# Altium schematic sheet Receiver_Schematic.SchDoc
size A4
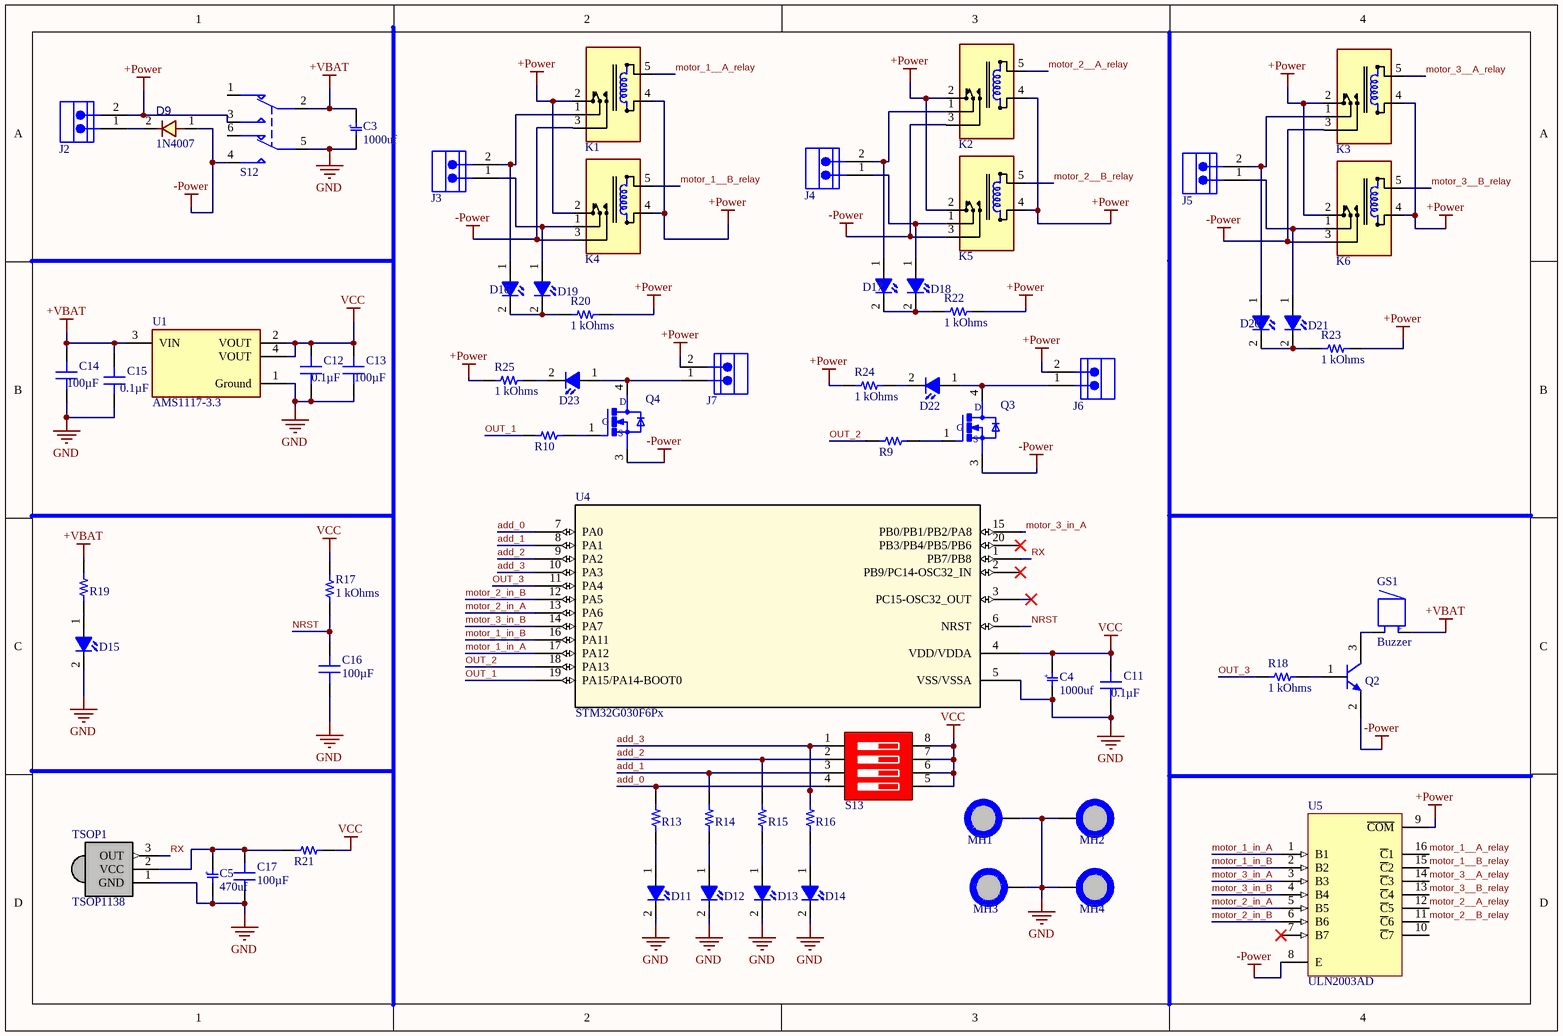
[diagram p0: Receiver_Schematic.SchDoc]

## Parts
C3  value 1000uf  [Cap_3_(3.5mm)]  (hidden comment: Capacitor Electrical THD)
C4  value 1000uf  [Cap_3_(3.5mm)]  (hidden comment: Capacitor Electrical THD)
C5  value 470uf  [Cap_3_(3.5mm)]  (hidden comment: Capacitor Electrical THD)
C11  0.1µF  [CAP 0805_2012]
C12  0.1µF  [CAP 0805_2012]
C13  100µF  [CAP 0805_2012]
C14  100µF  [CAP 0805_2012]
C15  0.1µF  [CAP 0805_2012]
C16  100µF  [CAP 0805_2012]
C17  100µF  [CAP 0805_2012]
D9  value 1N4007  [D_SMA]  (hidden comment: 1N4007 SMD M7)
D11  LED THD 3mm  [LED THD 3mm (White)]  (value not drawn)
D12  LED THD 3mm  [LED THD 3mm (White)]  (value not drawn)
D13  LED THD 3mm  [LED THD 3mm (White)]  (value not drawn)
D14  LED THD 3mm  [LED THD 3mm (White)]  (value not drawn)
D15  LED THD 3mm  [LED THD 3mm (White)]  (value not drawn)
D16  LED THD 3mm  [LED THD 3mm (White)]  (value not drawn)
D17  LED THD 3mm  [LED THD 3mm (White)]  (value not drawn)
D18  LED THD 3mm  [LED THD 3mm (White)]  (value not drawn)
D19  LED THD 3mm  [LED THD 3mm (White)]  (value not drawn)
D20  LED THD 3mm  [LED THD 3mm (White)]  (value not drawn)
D21  LED THD 3mm  [LED THD 3mm (White)]  (value not drawn)
D22  LED THD 3mm  [LED THD 3mm (White)]  (value not drawn)
D23  LED THD 3mm  [LED THD 3mm (White)]  (value not drawn)
GS1  Buzzer  [BZ_SJ]
J2  Socket Blue 2  [Socket Blue 2]  (value not drawn)
J3  Socket Blue 2  [Socket Blue 2]  (value not drawn)
J4  Socket Blue 2  [Socket Blue 2]  (value not drawn)
J5  Socket Blue 2  [Socket Blue 2]  (value not drawn)
J6  Socket Blue 2  [Socket Blue 2]  (value not drawn)
J7  Socket Blue 2  [Socket Blue 2]  (value not drawn)
K1  RELAY SPST 5 Pin Millon  [REL_SPDT_5_2216]  (value not drawn)
K2  RELAY SPST 5 Pin Millon  [REL_SPDT_5_2216]  (value not drawn)
K3  RELAY SPST 5 Pin Millon  [REL_SPDT_5_2216]  (value not drawn)
K4  RELAY SPST 5 Pin Millon  [REL_SPDT_5_2216]  (value not drawn)
K5  RELAY SPST 5 Pin Millon  [REL_SPDT_5_2216]  (value not drawn)
K6  RELAY SPST 5 Pin Millon  [REL_SPDT_5_2216]  (value not drawn)
MH1  MH_7.4mmC_3.2mmD  [MH_7.4mmC_3.2mmD]  (value not drawn)  (no BOM)
MH2  MH_7.4mmC_3.2mmD  [MH_7.4mmC_3.2mmD]  (value not drawn)  (no BOM)
MH3  MH_7.4mmC_3.2mmD  [MH_7.4mmC_3.2mmD]  (value not drawn)  (no BOM)
MH4  MH_7.4mmC_3.2mmD  [MH_7.4mmC_3.2mmD]  (value not drawn)  (no BOM)
Q2  MMBT2222A-7-F  [DIODES SOT-23-3]  (value not drawn)
Q3  PHD45N03LTA  [TO228P1000X238-3N]  (value not drawn)
Q4  PHD45N03LTA  [TO228P1000X238-3N]  (value not drawn)
R9  100 Ohms  [RES 0805_2012]  (value not drawn)
R10  100 Ohms  [RES 0805_2012]  (value not drawn)
R13  50 mOhms  [RES 0805_2012]  (value not drawn)
R14  50 mOhms  [RES 0805_2012]  (value not drawn)
R15  50 mOhms  [RES 0805_2012]  (value not drawn)
R16  50 mOhms  [RES 0805_2012]  (value not drawn)
R17  1 kOhms  [RES 0805_2012]
R18  1 kOhms  [RES 0805_2012]
R19  150 Ohms  [RES 0805_2012]  (value not drawn)
R20  1 kOhms  [RES 0805_2012]
R21  100 Ohms  [RES 0805_2012]  (value not drawn)
R22  1 kOhms  [RES 0805_2012]
R23  1 kOhms  [RES 0805_2012]
R24  1 kOhms  [RES 0805_2012]
R25  1 kOhms  [RES 0805_2012]
S12  Double Switch  [SWPUST_DPDT_S2]  (value not drawn)
S13  DIP Switch 4  [dip switch 4  Blue THD]  (value not drawn)
TSOP1  TSOP1138  [TSOP11XX & 13XX]
U1  AMS1117-3.3  [SOT223-4N]
U4  STM32G030F6Px  [TSSOP20]
U5  ULN2003AD  [SOIC16]

## Nets
+Power: J2.2 J6.2 J7.2 K1.2(NC) K1.4(T1) K2.2(NC) K2.4(T1) K3.2(NC) K3.4(T1) K4.2(NC) K4.4(T1) K5.2(NC) K5.4(T1) K6.2(NC) K6.4(T1) R20.2 R22.2 R23.2 R24.1 R25.1 S12.3 U5.9(~{COM})
+VBAT: C3.1 C14.2 C15.2 GS1.1(+) R19.2 S12.2 U1.3(VIN)
-Power: D9.1 K1.3(NO) K2.3(NO) K3.3(NO) K4.3(NO) K5.3(NO) K6.3(NO) Q2.2(E) Q3.3(S) Q4.3(S) S12.4 U5.8(E)
GND: C3.2 C4.2 C5.2 C11.1 C12.1 C13.1 C14.1 C15.1 C16.1 C17.1 D11.2(CATHODE) D12.2(CATHODE) D13.2(CATHODE) D14.2(CATHODE) D15.2(CATHODE) MH1.0 MH2.0 MH3.0 MH4.0 S12.5 TSOP1.1(GND) U1.1(Ground) U4.5(VSS/VSSA)
VCC: C4.1 C11.2 C12.2 C13.2 R17.1 R21.2 S13.5 S13.6 S13.7 S13.8 U1.2(VOUT) U1.4(VOUT) U4.4(VDD/VDDA)
add_0: R13.2 S13.4 U4.7(PA0)
add_1: R14.2 S13.3 U4.8(PA1)
add_2: R15.2 S13.2 U4.9(PA2)
add_3: R16.2 S13.1 U4.10(PA3)
motor_1__A_relay: K1.5(T2) U5.16(~{C}1)
motor_1__B_relay: K4.5(T2) U5.15(~{C}2)
motor_1_in_A: U4.17(PA12) U5.1(B1)
motor_1_in_B: U4.16(PA11) U5.2(B2)
motor_2__A_relay: K2.5(T2) U5.12(~{C}5)
motor_2__B_relay: K5.5(T2) U5.11(~{C}6)
motor_2_in_A: U4.13(PA6) U5.5(B5)
motor_2_in_B: U4.12(PA5) U5.6(B6)
motor_3__A_relay: K3.5(T2) U5.14(~{C}3)
motor_3__B_relay: K6.5(T2) U5.13(~{C}4)
motor_3_in_A: U4.15(PB0/PB1/PB2/PA8) U5.3(B3)
motor_3_in_B: U4.14(PA7) U5.4(B4)
NRST: C16.2 R17.2 U4.6(NRST)
OUT_1: R10.1 U4.19(PA15/PA14-BOOT0)
OUT_2: R9.1 U4.18(PA13)
OUT_3: R18.1 U4.11(PA4)
RX: TSOP1.3(OUT) U4.1(PB7/PB8)
NetC5_1: C5.1 C17.2 R21.1 TSOP1.2(VCC)
NetD9_2: D9.2 J2.1
NetD11_1: D11.1(ANODE) R13.1
NetD12_1: D12.1(ANODE) R14.1
NetD13_1: D13.1(ANODE) R15.1
NetD14_1: D14.1(ANODE) R16.1
NetD15_1: D15.1(ANODE) R19.1
NetD16_1: D16.1(ANODE) J3.2 K1.1(COM)
NetD16_2: D16.2(CATHODE) D19.2(CATHODE) R20.1
NetD17_1: D17.1(ANODE) J4.2 K2.1(COM)
NetD17_2: D17.2(CATHODE) D18.2(CATHODE) R22.1
NetD18_1: D18.1(ANODE) J4.1 K5.1(COM)
NetD19_1: D19.1(ANODE) J3.1 K4.1(COM)
NetD20_1: D20.1(ANODE) J5.2 K3.1(COM)
NetD20_2: D20.2(CATHODE) D21.2(CATHODE) R23.1
NetD21_1: D21.1(ANODE) J5.1 K6.1(COM)
NetD22_1: D22.1(ANODE) J6.1 Q3.4(D)
NetD22_2: D22.2(CATHODE) R24.2
NetD23_1: D23.1(ANODE) J7.1 Q4.4(D)
NetD23_2: D23.2(CATHODE) R25.2
NetGS1_2: GS1.2(-) Q2.3(C)
NetQ2_1: Q2.1(B) R18.2
NetQ3_1: Q3.1(G) R9.2
NetQ4_1: Q4.1(G) R10.2

Not connected (* = marked no-connect by the designer): S12 1 6; U4 2(PB9/PC14-OSC32_IN)* 3(PC15-OSC32_OUT)* 20(PB3/PB4/PB5/PB6)*; U5 7(B7)* 10(~{C}7)

## Notes on the sheet
- (in symbol Capacitor Electrical THD) +

## Library data of the parts
C11 C12 C15 = AC0805KKX8R9BB104: CAP CER 0805 10% X8R 50V 100NF; Manufacturer: Yageo; Part Number: AC0805KKX8R9BB104; Applications: Automotive; Capacitance: 0.1µF; ComponentLink1Description: Datasheet; ComponentLink1URL: http://www.yageo.com/documents/recent/AC0805KKX8R9BB104.pdf; ComponentLink2Description: DigiKey Link; ComponentLink2URL: http://digikey.com/product-detail/en/yageo/AC0805KKX8R9BB104/311-4624-1-ND/9699550; Device Package: 0805 (2012 Metric); LastUpdated: 2020-09-02 01:04:19.917000; Lifecycle Status: Active; Minimum Order: 1; Mounting Type: Surface Mount, MLCC; Operating Temperature: -55°C ~ 150°C; Package / Case: 0805 (2012 Metric); Packaging: TapeAndReel; PartId: 14076; Part Status: Active; Price: 0.06; Ratings: AEC-Q200; Series: AC; Size / Dimension: 0.079 L x 0.049 W (2.00mm x 1.25mm); Supplier 1: DigiKey; Supplier Part Number 1: 311-4624-1-ND; Temperature Coefficient: X8R; Thickness (Max): 0.057 (1.45mm); Tolerance: ±10%; Value: 0.1µF; Voltage - Rated: 50V
C13 C14 C16 C17 = GRM21BR60J107ME15L: CAP CER 100UF 6.3V X5R 0805; Manufacturer: Murata Electronics; Tolerance: ±20%; Part Number: GRM21BR60J107ME15L; Applications: General Purpose; Capacitance: 100µF; ComponentLink1Description: Datasheet; ComponentLink1URL: https://search.murata.co.jp/Ceramy/image/img/A01X/G101/ENG/GRM21BR60J107ME15-01.pdf; ComponentLink2Description: DigiKey Link; ComponentLink2URL: http://digikey.com/product-detail/en/murata-electronics/GRM21BR60J107ME15L/490-13981-1-ND/6155811; Device Package: 0805 (2012 Metric); LastUpdated: 2020-09-02 01:04:10.617000; Lifecycle Status: Active; Minimum Order: 1; Mounting Type: Surface Mount, MLCC; Operating Temperature: -55°C ~ 85°C; Package / Case: 0805 (2012 Metric); Packaging: TapeAndReel; PartId: 16995; Part Status: Active; Price: 0.61; Series: GRM; Size / Dimension: 0.079 L x 0.049 W (2.00mm x 1.25mm); Supplier 1: DigiKey; Supplier Part Number 1: 490-13981-1-ND; Temperature Coefficient: X5R; Thickness (Max): 0.057 (1.45mm); Value: 100µF; Voltage - Rated: 6.3V
D9 = 1N4007 SMD M7: DIODE, GENERAL PURPOSE, 1000V/1A; DatasheetVersion: 2021; ComponentLink1Description: Website Smart World; ComponentLink1URL: https://www.smartw.ir/; ComponentLink2Description: Telegram; ComponentLink2URL: https://t.me/altium_smartw; ComponentLink3Description: Instagram; ComponentLink3URL: https://Instagram.com/smartgw.ir
GS1 = Buzzer: Magnetic Transducer Buzzer; Company: SJ Libraries; Designer: Eng. Saeid Jorablo; PackageReference: ABSM-1574; PackageDescription: Magnetic Transducer Buzzer; Mounting Technology: Surface Mount\Through-Hole; ComponentLink1Description: Datasheet; Pin Count: 0; Category: MISC; HelpURL: http://s3.picofile.com/file/7443264187/Coming_Soon_logo.gif; ComponentLink2Description: Reference; Publisher: SJ Unlimited; Status: Unreleased
K1-K6 = RELAY SPST 5 Pin Millon: Relay; ComponentLinkp-URL: https://www.smartw.ir/; DatasheetVersion: 2021; ComponentLink1Description: Website Smart World; ComponentLink1URL: https://www.smartw.ir/; ComponentLink2Description: Telegram; ComponentLink2URL: https://t.me/altium_smartw; ComponentLink3Description: Instagram; ComponentLink3URL: https://Instagram.com/smartgw.ir
MH1-MH4 = MH_7.4mmC_3.2mmD: MH_7.4MM Diameter,3.2mm Drill
Q2 = MMBT2222A-7-F: TRANS NPN 40V 0.6A SMD SOT23-3; Manufacturer: Diodes Incorporated; Current - Collector Cutoff (Max): 10nA (ICBO); Current - Collector (Ic) (Max): 600mA; DC Current Gain (hFE) (Min) @ Ic, Vce: 100 @ 150mA, 10V; Frequency - Transition: 300MHz; Power - Max: 310mW; Vce Saturation (Max) @ Ib, Ic: 1V @ 50mA, 500mA; Part Number: MMBT2222A-7-F; ComponentLink1Description: Datasheet; ComponentLink1URL: https://www.diodes.com/assets/Datasheets/ds30041.pdf; ComponentLink2Description: DigiKey Link; ComponentLink2URL: http://digikey.com/product-detail/en/diodes-incorporated/MMBT2222A-7-F/MMBT2222A-FDICT-ND/815723; LastUpdated: 2020-09-02 01:30:06.317000; Lifecycle Status: Active; Minimum Order: 1; Mounting Type: Surface Mount; Operating Temperature: -55°C ~ 150°C (TJ); Package / Case: TO-236-3, SC-59, SOT-23-3; Packaging: TapeAndReel; PartId: 84; Part Status: Active; Price: 0.02; Series: Automotive, AEC-Q101; Supplier 1: DigiKey; Supplier Part Number 1: MMBT2222A-FDICT-ND; Supplier Device Package: SOT-23-3; Transistor Type: NPN; Voltage - Collector Emitter Breakdown (Max): 40V
Q3 Q4 = PHD45N03LTA: Bipolar Transistors - BJT; MF: NXP USA; Package: TO-252-3 NXP USA; Price: None; SnapEDA_Link: https://www.snapeda.com/parts/PHD45N03LTA/NXP%20USA%20Inc./view-part/554376/?ref=snap; Availability: Unavailable; Value: *; MP: PHD45N03LTA
R9 R10 = RCS0805100RFKEA: RES SMD 100 OHM 1% 0.4W 0805; Manufacturer: Vishay Dale; Power (Watts): 0.4W, 2/5W; Temperature Coefficient: ±100ppm/°C; Part Number: RCS0805100RFKEA; ComponentLink1Description: Datasheet; ComponentLink1URL: http://www.vishay.com/docs/20065/rcse3.pdf; ComponentLink2Description: DigiKey Link; ComponentLink2URL: http://digikey.com/product-detail/en/vishay-dale/RCS0805100RFKEA/541-2834-1-ND/5867127; Composition: Thick Film; Device Package: 0805 (2012 Metric); Features: Automotive AEC-Q200, Pulse Withstanding; Height - Seated (Max): 0.020 (0.50mm); LastUpdated: 2020-09-02 01:15:23.790000; Lifecycle Status: Active; Minimum Order: 1; Number of Terminations: 2; Operating Temperature: -55°C ~ 155°C; Package / Case: 0805 (2012 Metric); Packaging: TapeAndReel; PartId: 27784; Part Status: Active; Price: 0.03; Ratings: AEC-Q200; Resistance: 100 Ohms; Series: RCS e3; Size / Dimension: 0.079 L x 0.049 W (2.00mm x 1.25mm); Supplier 1: DigiKey; Supplier Part Number 1: 541-2834-1-ND; Supplier Device Package: 0805; Tolerance: ±1%; Value: 100 Ohms
R13-R16 = CRM0805-FW-R050ELF: RES 0.05 OHM 1% 1/4W 0805; Manufacturer: Bourns Inc.; Power (Watts): 0.25W, 1/4W; Temperature Coefficient: ±200ppm/°C; Part Number: CRM0805-FW-R050ELF; ComponentLink1Description: Datasheet; ComponentLink1URL: https://www.bourns.com/docs/Product-Datasheets/CRM0805_1206_2010.pdf; ComponentLink2Description: DigiKey Link; ComponentLink2URL: http://digikey.com/product-detail/en/bourns-inc/CRM0805-FW-R050ELF/CRM0805-FW-R050ELFCT-ND/3592903; Composition: Thick Film; Device Package: 0805 (2012 Metric); Features: Current Sense; Height - Seated (Max): 0.024 (0.60mm); LastUpdated: 2020-09-02 01:15:22.390000; Lifecycle Status: Active; Minimum Order: 1; Number of Terminations: 2; Operating Temperature: -55°C ~ 155°C; Package / Case: 0805 (2012 Metric); Packaging: TapeAndReel; PartId: 28469; Part Status: Active; Price: 0.14; Resistance: 50 mOhms; Series: CRM0805; Size / Dimension: 0.079 L x 0.047 W (2.00mm x 1.20mm); Supplier 1: DigiKey; Supplier Part Number 1: CRM0805-FW-R050ELFCT-ND; Supplier Device Package: 0805; Tolerance: ±1%; Value: 50 mOhms
R17 R18 R20 R22-R25 = RNCP0805FTD1K00: RES 1K OHM 1% 1/4W 0805; Manufacturer: Stackpole Electronics Inc; Power (Watts): 0.25W, 1/4W; Temperature Coefficient: ±100ppm/°C; Part Number: RNCP0805FTD1K00; ComponentLink1Description: Datasheet; ComponentLink1URL: https://www.seielect.com/catalog/sei-rncp.pdf; ComponentLink2Description: DigiKey Link; ComponentLink2URL: http://digikey.com/product-detail/en/stackpole-electronics-inc/RNCP0805FTD1K00/RNCP0805FTD1K00CT-ND/2240568; Composition: Thin Film; Device Package: 0805 (2012 Metric); Features: Anti-Sulfur, Moisture Resistant; Height - Seated (Max): 0.024 (0.60mm); LastUpdated: 2020-09-02 01:15:23.347000; Lifecycle Status: Active; Minimum Order: 1; Number of Terminations: 2; Operating Temperature: -55°C ~ 155°C; Package / Case: 0805 (2012 Metric); Packaging: TapeAndReel; PartId: 28023; Part Status: Active; Price: 0.01; Resistance: 1 kOhms; Series: RNCP; Size / Dimension: 0.079 L x 0.049 W (2.00mm x 1.25mm); Supplier 1: DigiKey; Supplier Part Number 1: RNCP0805FTD1K00CT-ND; Supplier Device Package: 0805; Tolerance: ±1%; Value: 1 kOhms
R19 = CRGP0805F150R: CRGP 0805 150R 1%; Manufacturer: TE Connectivity Passive Product; Power (Watts): 0.333W, 1/3W; Temperature Coefficient: ±100ppm/°C; Part Number: CRGP0805F150R; ComponentLink1Description: Datasheet; ComponentLink1URL: https://www.te.com/commerce/DocumentDelivery/DDEController?Action=srchrtrv&DocNm=9-1773463-9&DocType=DS&DocLang=English; ComponentLink2Description: DigiKey Link; ComponentLink2URL: http://digikey.com/product-detail/en/te-connectivity-passive-product/CRGP0805F150R/A130467CT-ND/8578299; Composition: Thick Film; Device Package: 0805 (2012 Metric); Features: Pulse Withstanding; Height - Seated (Max): 0.026 (0.65mm); LastUpdated: 2020-09-02 01:15:21.910000; Lifecycle Status: Active; Minimum Order: 1; Number of Terminations: 2; Operating Temperature: -55°C ~ 155°C; Package / Case: 0805 (2012 Metric); Packaging: TapeAndReel; PartId: 28713; Part Status: Active; Price: 0.02; Resistance: 150 Ohms; Series: CRGP; Size / Dimension: 0.079 L x 0.049 W (2.00mm x 1.25mm); Supplier 1: DigiKey; Supplier Part Number 1: A130467CT-ND; Supplier Device Package: 0805; Tolerance: ±1%; Value: 150 Ohms
R21 = CRGP0805F100R: CRGP 0805 100R 1%; Manufacturer: TE Connectivity Passive Product; Power (Watts): 0.333W, 1/3W; Temperature Coefficient: ±200ppm/°C; Part Number: CRGP0805F100R; ComponentLink1Description: Datasheet; ComponentLink1URL: https://www.te.com/commerce/DocumentDelivery/DDEController?Action=srchrtrv&DocNm=9-1773463-9&DocType=DS&DocLang=English; ComponentLink2Description: DigiKey Link; ComponentLink2URL: http://digikey.com/product-detail/en/te-connectivity-passive-product/CRGP0805F100R/A130465CT-ND/8578297; Composition: Thick Film; Device Package: 0805 (2012 Metric); Features: Pulse Withstanding; Height - Seated (Max): 0.026 (0.65mm); LastUpdated: 2020-09-02 01:14:53.183000; Lifecycle Status: Active; Minimum Order: 1; Number of Terminations: 2; Operating Temperature: -55°C ~ 155°C; Package / Case: 0805 (2012 Metric); Packaging: TapeAndReel; PartId: 41705; Part Status: Active; Price: 0.02; Resistance: 100 Ohms; Series: CRGP; Size / Dimension: 0.079 L x 0.049 W (2.00mm x 1.25mm); Supplier 1: DigiKey; Supplier Part Number 1: A130465CT-ND; Supplier Device Package: 0805; Tolerance: ±1%; Value: 100 Ohms
S12 = SW DPDT: DPDT Switch; ComponentLink1Description: Website Smart World; ComponentLink1URL: https://www.smartw.ir/; ComponentLink2Description: Telegram; ComponentLink2URL: https://t.me/altium_smartw; ComponentLink3Description: Instagram; ComponentLink3URL: https://Instagram.com/smartgw.ir; DatasheetVersion: 2021
S13 = DIP Switch 4: 4 BIT DIP Switch; ComponentLink1Description: Website Smart World; ComponentLink1URL: https://www.smartw.ir/; ComponentLink2Description: Telegram; ComponentLink2URL: https://t.me/altium_smartw; ComponentLink3Description: Instagram; ComponentLink3URL: https://Instagram.com/smartgw.ir; DatasheetVersion: 2021
TSOP1 = TSOP1138: IR Receiver Modules for Remote Control Systems; ComponentLinkp-URL: https://www.smartw.ir/; DatasheetVersion: 2021; ComponentLink1Description: Website Smart World; ComponentLink1URL: https://www.smartw.ir/; ComponentLink2Description: Telegram; ComponentLink2URL: https://t.me/altium_smartw; ComponentLink3Description: Instagram; ComponentLink3URL: https://Instagram.com/smartgw.ir
U1 = CMP-209535-000001-1: LDO Voltage Regulators 1A, 3.3V; Manufacturer: Advanced Monolithic Systems; Dropout Voltage: 1.1V; Output Type: Fixed; Nominal Supply Current: 5mA; Max Power Dissipation: 1.2W; Max Supply Voltage: 15V; Number Of Outputs: 1; Standoff Height: 0.64mm; Max Junction Temp: +125°C; Height: 1.8mm; Package: AMS1117; Device Class L2: Power Management ICs; ComponentLink2Description: Datasheet; ComponentLink2URL: http://www.advanced-monolithic.com/pdf/ds1117.pdf; Category: IC; RoHS: TRUE; Automotive: No; Device Class L1: Integrated Circuits (ICs); Output Current: 1A; Device Class L3: Voltage Regulators - Linear; Temperature: -40°C to +125°C; Output Voltage: 3.3V; Manufacturer Part Number: AMS1117-3.3; Temperature Range Low: -40°C; Octopart: https://octopart.com/ams1117-3.3-advanced+monolithic+systems-25899300; Lead Free: Yes; Ipc Land Pattern Name: SOT229P700X180-4; Temperature Range High: +125°C
U4 = STM32G030F6Px: The STM32G030x6/x8 mainstream microcontrollers are based on high-performance Arm® Cortex®-M0+ 32-bit RISC core operating at up to 64 MHz frequency. / 32K Flash and 8K RAM with 20pin TSSOP 6.4x4.4mm package; Manufacturer_Part_Number: stm32g0_tssop20_t1; Vendor: STMicroelectronics; Copyright: Copyright (C) 2018 Accelerated Designs. All rights reserved; RefDes: RefDes; Type: DEV; Value: Value
U5 = ULN2003AD: Darlington Transistor Array; Published: 15-May-2002; LatestRevisionDate: 13-Apr-2006; LatestRevisionNote: IPC-7351 Footprint Added.; DatasheetVersion: Sep-1986; PackageVersion: Jan-1998; PackageReference: D016; Publisher: Altium Limited; PackageDescription: 16-Pin Small Outline Integrated Circuit 1.27 mm Pitch; Code_IPC: SOIC127P600-16; ComponentLink1Description: Manufacturer Link; ComponentLink1URL: http://www.ti.com/; ComponentLink2Description: Datasheet; ComponentLink2URL: http://www-s.ti.com/sc/ds/uln2002a.pdf
C3-C5 = Capacitor Electrical THD: DatasheetVersion: 2021; ComponentLink1Description: Website Smart World; ComponentLink1URL: https://www.smartw.ir/; ComponentLink2Description: Telegram; ComponentLink2URL: https://t.me/altium_smartw; ComponentLink3Description: Instagram; ComponentLink3URL: https://Instagram.com/smartgw.ir
D11-D23 = LED THD 3mm: ComponentLink1Description: Website Smart World; ComponentLink1URL: https://www.smartw.ir/; ComponentLink2Description: Telegram; ComponentLink2URL: https://t.me/altium_smartw; ComponentLink3Description: Instagram; ComponentLink3URL: https://Instagram.com/smartgw.ir; DatasheetVersion: 2021
J2-J7 = Socket Blue 2: ComponentLink1Description: Website Smart World; ComponentLink1URL: https://www.smartw.ir/*; ComponentLink2Description: Telegram; ComponentLink2URL: https://t.me/altium_smartw; ComponentLink3Description: Instagram; ComponentLink3URL: https://Instagram.com/smartgw.ir; DatasheetVersion: 2021